# Altium schematic sheet Output.SchDoc
size A; SheetNumber: 4; SheetTotal: 7
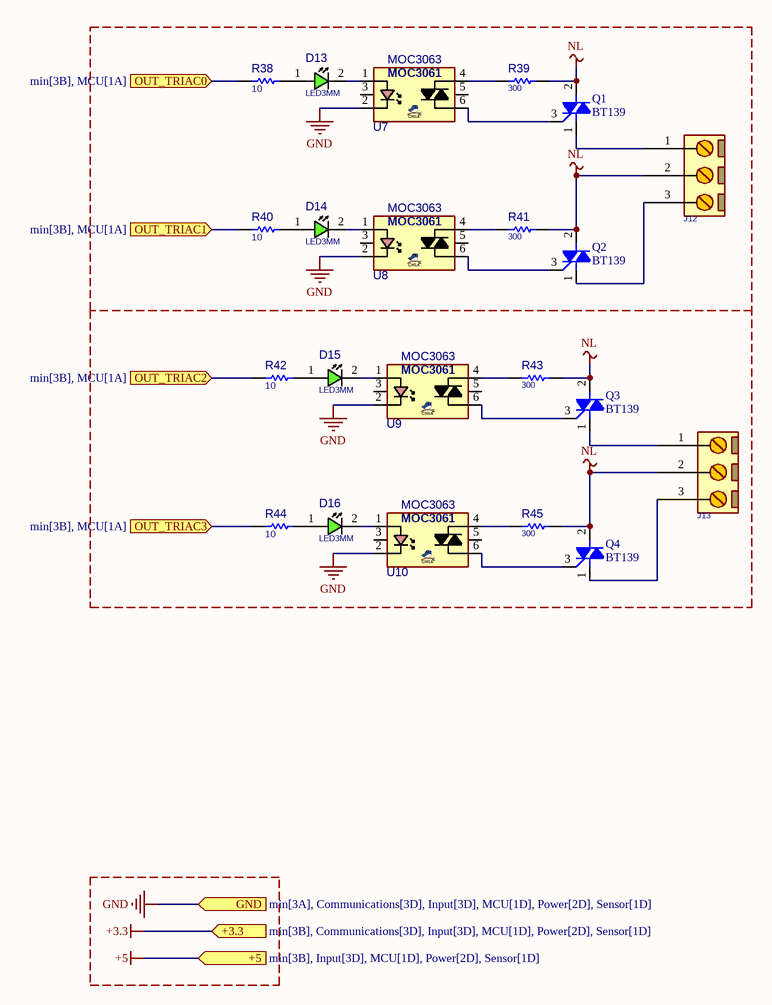
[diagram p0: Output.SchDoc]

## Parts
D13  LED3MM  [LED3MM]
D14  LED3MM  [LED3MM]
D15  LED3MM  [LED3MM]
D16  LED3MM  [LED3MM]
J12  CONN_GMSTB3  [GMSTB762_3]  (value not drawn)
J13  CONN_GMSTB3  [GMSTB762_3]  (value not drawn)
Q1  BT139  [TO220_3]
Q2  BT139  [TO220_3]
Q3  BT139  [TO220_3]
Q4  BT139  [TO220_3]
R38  10  [R1206]
R39  300  [R025W_AX_VER]
R40  10  [R1206]
R41  300  [R025W_AX_VER]
R42  10  [R1206]
R43  300  [R025W_AX_VER]
R44  10  [R1206]
R45  300  [R025W_AX_VER]
U7  MOC3063  [DIP_6]
U8  MOC3063  [DIP_6]
U9  MOC3063  [DIP_6]
U10  MOC3063  [DIP_6]

## Ports
+3.3 (in, see min[3B], Communications[3D], Input[3D], MCU[1D], Power[2D], Sensor[1D]), +5 (in, see min[3B], Input[3D], MCU[1D], Power[2D], Sensor[1D]), GND (in, see min[3A], Communications[3D], Input[3D], MCU[1D], Power[2D], Sensor[1D]), OUT_TRIAC0 (in, see min[3B], MCU[1A]), OUT_TRIAC1 (in, see min[3B], MCU[1A]), OUT_TRIAC2 (in, see min[3B], MCU[1A]), OUT_TRIAC3 (in, see min[3B], MCU[1A])

## Nets
+3.3: port +3.3
+5: port +5
GND: U7.2(K) U8.2(K) U9.2(K) U10.2(K) ; port GND
NL: J12.2 J13.2 Q1.2(T2) Q2.2(T2) Q3.2(T2) Q4.2(T2) R39.2 R41.2 R43.2 R45.2
OUT_TRIAC0: R38.1 ; port OUT_TRIAC0
OUT_TRIAC1: R40.1 ; port OUT_TRIAC1
OUT_TRIAC2: R42.1 ; port OUT_TRIAC2
OUT_TRIAC3: R44.1 ; port OUT_TRIAC3
NetD13_1: D13.1(ANODE) R38.2
NetD13_2: D13.2(CATHODE) U7.1(A)
NetD14_1: D14.1(ANODE) R40.2
NetD14_2: D14.2(CATHODE) U8.1(A)
NetD15_1: D15.1(ANODE) R42.2
NetD15_2: D15.2(CATHODE) U9.1(A)
NetD16_1: D16.1(ANODE) R44.2
NetD16_2: D16.2(CATHODE) U10.1(A)
NetJ12_1: J12.1 Q1.1(T1)
NetJ12_3: J12.3 Q2.1(T1)
NetJ13_1: J13.1 Q3.1(T1)
NetJ13_3: J13.3 Q4.1(T1)
NetQ1_3: Q1.3(G) U7.6(A/K)
NetQ2_3: Q2.3(G) U8.6(A/K)
NetQ3_3: Q3.3(G) U9.6(A/K)
NetQ4_3: Q4.3(G) U10.6(A/K)
NetR39_1: R39.1 U7.4(A/K)
NetR41_1: R41.1 U8.4(A/K)
NetR43_1: R43.1 U9.4(A/K)
NetR45_1: R45.1 U10.4(A/K)

Not connected (* = marked no-connect by the designer): U7 3(NC) 5(NC); U8 3(NC) 5(NC); U9 3(NC) 5(NC); U10 3(NC) 5(NC)

## Library data of the parts
D13-D16 = LED_THD_3MM: LED, THD, 3MM, GREEN; DESC: DESCRIPTION; MANF_P#: MANF_PART#; PARAM2: 2.2V; MANF: MANF; ASSEMBLY: ASSEMBLY; PRICE: PRICE; VALUE: LED3MM
J12 J13 = CONN_GMSTB762_3: CONN, PHOENIX MSTB, 5-G, 5.08mm pitch; MANF_P#: GMSTB 2,5/3-G-7,62; PARAM2: 630V; PARAM: 12A; VALUE: CONN_GMSTB3
Q1-Q4 = TRIAC: Triac, 600V, 4A, TO-220, Silicon Bidirectional Thyristor; VALUE: BT136; MANF_P#: *; MANF: *; PRICE: toman@PAYA
R38 R40 R42 R44 = RES_SMD: RESISTOR, SMD; PARAM: -W; DESC: DESCRIPTION; DIST#: MOUSER; PARAM2: 1%; VALUE: 470; MANF_P#: -; MANF: -; ASSEMBLY: ASSEMBLY; PRICE: 100= 0.5$
R39 R41 R43 R45 = RES_THD: RESISTOR, THD; MANF_P#: RK73H1ETTP4701F; MANF: KOA SPEER; PARAM: 0.063W; DESC: DESCRIPTION; DIST#: MOUSER; PARAM2: 1%; ASSEMBLY: ASSEMBLY; PRICE: 100= 0.5$; VALUE: 300
U7-U10 = OPT_TRIAC6P_MOC3061: OPTOTRIAC, 600v/1A, 6v In; PARAM2: 300mW, -40~85°C; PARAM: 6v/60mA IN/ 600v/1A out; MANF_P#: MOC3061; PRICE: 5t@paya; VALUE: MOC3061; PACKAGE: DIP-6